# EAGLE design ItsyBitsy_Basic (EAGLE 9.6.2)
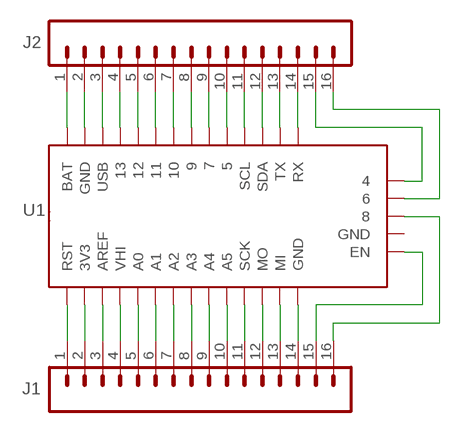
[diagram p0: schematic, sheet 1]

## Parts
J1  CONN_161X16_NO_SILK  [1X16_NO_SILK]
J2  CONN_161X16_NO_SILK  [1X16_NO_SILK]
U1  ITSYBITSY-32U4-3V  [ITSYBITYS-32U4]

## Nets
3V-5V: J1.2 U1.P$2(3V3)
4: J2.15 U1.P$19
5: J2.10 U1.P$24
6: J2.16 U1.P$18
7: J2.9 U1.P$25
8: J1.16 U1.P$17
9: J2.8 U1.P$26
10: J2.7 U1.P$27
11: J2.6 U1.P$28
12: J2.5 U1.P$29
13: J2.4 U1.P$30
A0: J1.5 U1.P$5(A0)
A1: J1.6 U1.P$6(A1)
A2: J1.7 U1.P$7(A2)
A3: J1.8 U1.P$8(A3)
A4: J1.9 U1.P$9(A4)
A5: J1.10 U1.P$10(A5)
AREF: J1.3 U1.P$3(AREF)
BAT: J2.1 U1.P$33(BAT)
EN: J1.15 U1.P$15(EN)
GND: J2.2 U1.P$32(GND)
GND-3V: J1.14 U1.P$14(GND)
M0: J1.12 U1.P$12(MO)
MI: J1.13 U1.P$13(MI)
RST: J1.1 U1.P$1(RST)
RX: J2.14 U1.P$20(RX)
SCK: J1.11 U1.P$11(SCK)
SCL: J2.11 U1.P$23(SCL)
SDA: J2.12 U1.P$22(SDA)
TX: J2.13 U1.P$21(TX)
USB: J2.3 U1.P$31(USB)
VHI-GND: J1.4 U1.P$4(VHI)

## Power pins joined to a net without a drawn wire
GND: U1.P$16(GND)

## Library data of the parts
J1 J2 = SparkFun-Connectors:CONN_16: Multi connection point. Often used as Generic Header-pin footprint for 0.1 inch spaced/style header connections On any of the 0.1 inch spaced packages, you can populate with these: Break Away Headers - Straight <https://www.sparkfun.com/products/116> (PRT-00116) Break Away Male Headers - Right Angle <https://www.sparkfun.com/products/553> (PRT-00553) Female Headers <https://www.sparkfun.com/products/115> (PRT-00115) Break Away Headers - Machine Pin <https://www.sparkfun.com/products/117> (PRT-00117) Break Away Female Headers - Swiss Machine Pin <https://www.sparkfun.com/products/743> (PRT-00743) For SCREWTERMINALS and SPRING TERMINALS visit here: Screw Terimnals on SparkFun.com <https://www.sparkfun.com/search/results?term=Screw+Terminals> (5mm/3.5mm/2.54mm spacing) This device is also useful as a general connection point to wire up your design to another part of your project. Our various solder wires solder well into these plated through hole pads. Hook-Up Wire - Assortment (Stranded, 22 AWG) <https://www.sparkfun.com/products/11375> (PRT-11375) Hook-Up Wire - Assortment (Solid Core, 22 AWG) <https://www.sparkfun.com/products/11367> (PRT-11367) View the entire wire category on our website here <https://www.sparkfun.com/categories/141> Special notes: Molex polarized connector foot print use with SKU : PRT-08231 with associated crimp pins and housings. 1MM SMD Version SKU: PRT-10208 NOTES ON THE VARIANTS LOCK and LOCK_LONGPADS... This footprint was designed to help hold the alignment of a through-hole component (i.e. 6-pin header) while soldering it into place. You may notice that each hole has been shifted either up or down by 0.005 of an inch from it's more standard position (which is a perfectly straight line). This slight alteration caused the pins (the squares in the middle) to touch the edges of the holes. Because they are alternating, it causes a "brace" to hold the component in place. 0.005 has proven to be the perfect amount of "off-center" position when using our standard breakaway headers. Although looks a little odd when you look at the bare footprint, once you have a header in there, the alteration is very hard to notice. Also,if you push a header all the way into place, it is covered up entirely on the bottom side.
U1 = home:ITSYBITSY-32U4-3V

## Net classes
0 default: width 0.203 mm

## Board
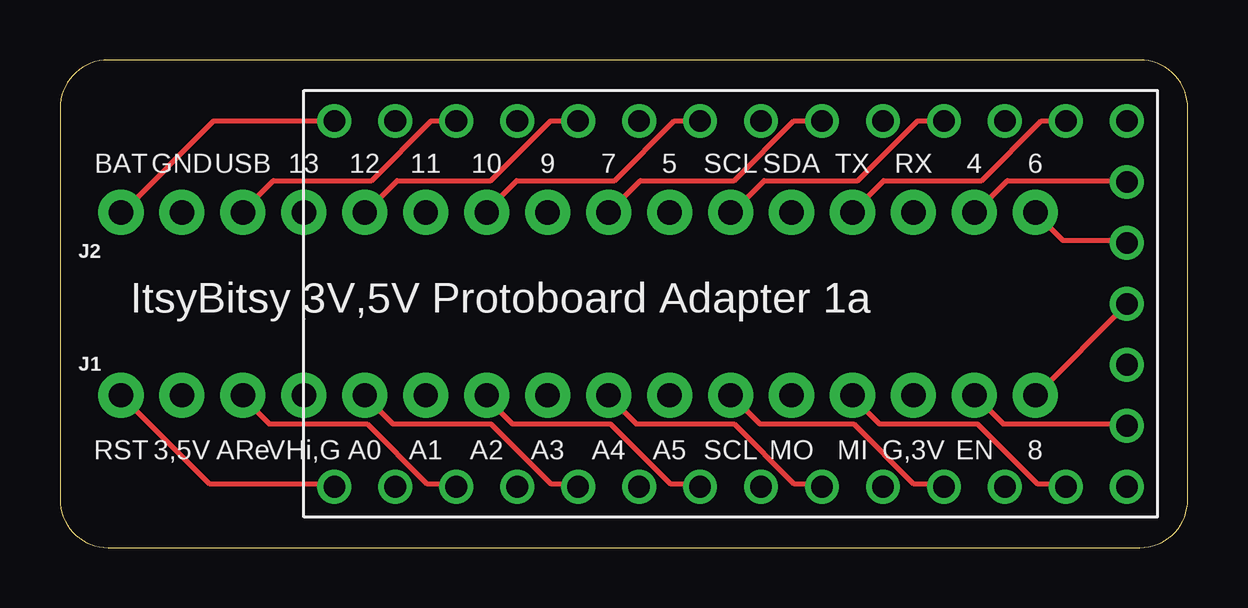
[diagram p1: board, top side]
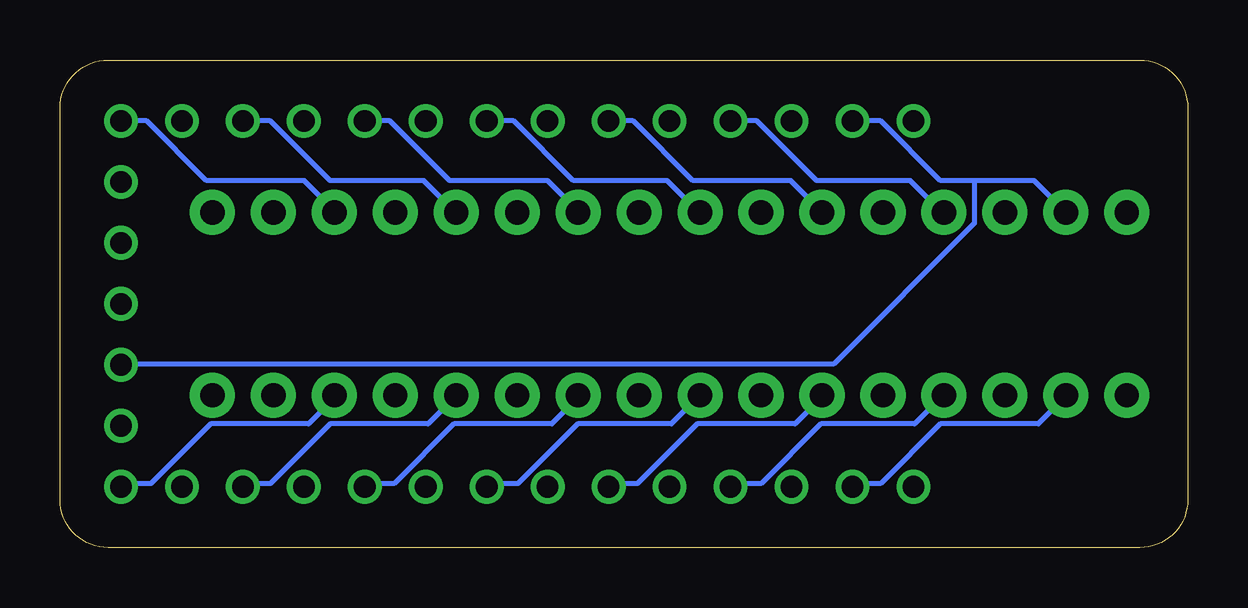
[diagram p2: board, bottom side, seen from below]

Size 46.99 x 20.32 mm. Coordinates in mm from the lower left corner, seen from the top.
Outline: 0,18.32 0,2 arc90 2,0 44.99,0 arc90 46.99,2 46.99,18.32 arc90 44.99,20.32 2,20.32 arc90 0,18.32
Copper layers (1*16): Top 0.035mm / dielectric 1.5mm / Bottom 0.035mm
Design rules "default": minimum track width 6mil, minimum drill 0.35mm, track to track 6mil, track to pad 6mil, pad to pad 6mil, via to via 6mil, smd to smd 6mil, copper to edge 40mil, drill to drill 6mil, minimum pad ring 10mil, minimum via ring 8mil, stop-mask expansion 4mil, vias tented up to drill 0mil, thermal gap 10mil

### Footprints (pad centres in the part's own frame; a part is rotated, then mirrored left to right if it is on the bottom)
1X16_NO_SILK = drill 1.016 pad 1.88: 1 0,0; 2 2.54,0; 3 5.08,0; 4 7.62,0; 5 10.16,0; 6 12.7,0; 7 15.24,0; 8 17.78,0; 9 20.32,0; 10 22.86,0; 11 25.4,0; 12 27.94,0; 13 30.48,0; 14 33.02,0; 15 35.56,0; 16 38.1,0
ITSYBITYS-32U4 = drill 0.9: P$1 -6.35,-7.62; P$2 -3.81,-7.62; P$3 -1.27,-7.62; P$4 1.27,-7.62; P$5 3.81,-7.62; P$6 6.35,-7.62; P$7 8.89,-7.62; P$8 11.43,-7.62; P$9 13.97,-7.62; P$10 16.51,-7.62; P$11 19.05,-7.62; P$12 21.59,-7.62; P$13 24.13,-7.62; P$14 26.67,-7.62; P$15 26.67,-5.08; P$16 26.67,-2.54; P$17 26.67,0; P$18 26.67,2.54; P$19 26.67,5.08; P$20 26.67,7.62; P$21 24.13,7.62; P$22 21.59,7.62; P$23 19.05,7.62; P$24 16.51,7.62; P$25 13.97,7.62; P$26 11.43,7.62; P$27 8.89,7.62; P$28 6.35,7.62; P$29 3.81,7.62; P$30 1.27,7.62; P$31 -1.27,7.62; P$32 -3.81,7.62; P$33 -6.35,7.62

### Placement (x,y rotation side)
J1  2.54,6.35 0 top
J2  2.54,13.97 0 top
U1  17.78,10.16 0 top

### Tracks (layer width: path | path; a pad name or v marks a point on that pad's centre or on a via)
3V-5V
  Bottom 0.203: U1.P$2 13.87,2.67 12.8,2.67 10.31,5.16 6.22,5.16 5.16,6.22 J1.2
4
  Top 0.203: U1.P$19 44.45,15.29 39.47,15.29 38.23,14.05 J2.15
5
  Bottom 0.203: U1.P$24 33.25,17.78 30.76,15.29 26.67,15.29 25.43,14.05 J2.10
6
  Top 0.203: U1.P$18 44.45,12.8 41.78,12.8 40.72,13.87 J2.16
7
  Top 0.203: U1.P$25 30.58,17.78 28.09,15.29 24.18,15.29 J2.9
8
  Top 0.203: U1.P$17 44.45,10.13 40.72,6.4 J1.16
9
  Bottom 0.203: U1.P$26 28.09,17.78 25.6,15.29 21.69,15.29 20.45,14.05 J2.8
10
  Top 0.203: U1.P$27 25.6,17.78 23.11,15.29 19.02,15.29 17.78,14.05 J2.7
11
  Bottom 0.203: U1.P$28 23.11,17.78 20.62,15.29 16.54,15.29 15.29,14.05 J2.6
12
  Top 0.203: U1.P$29 20.45,17.78 17.96,15.29 14.05,15.29 12.8,14.05 J2.5
13
  Bottom 0.203: U1.P$30 17.96,17.78 15.47,15.29 11.56,15.29 10.31,14.05 J2.4
A0
  Top 0.203: U1.P$5 21.51,2.67 20.45,2.67 17.96,5.16 13.87,5.16 12.8,6.22 J1.5
A1
  Bottom 0.203: U1.P$6 24,2.67 22.94,2.67 20.45,5.16 16.36,5.16 15.29,6.22 J1.6
A2
  Top 0.203: U1.P$7 26.67,2.67 25.43,2.67 22.94,5.16 18.85,5.16 17.78,6.22 J1.7
A3
  Bottom 0.203: J1.8 21.51,5.16 25.43,5.16 27.91,2.67 29.16,2.67 U1.P$8
A4
  Top 0.203: U1.P$9 31.65,2.67 30.58,2.67 28.09,5.16 24,5.16 22.94,6.22 J1.9
A5
  Bottom 0.203: U1.P$10 34.14,2.67 33.07,2.67 30.58,5.16 26.49,5.16 25.43,6.22 J1.10
AREF
  Top 0.203: U1.P$3 16.36,2.67 15.29,2.67 12.8,5.16 8.71,5.16 7.64,6.22 J1.3
BAT
  Top 0.203: U1.P$33 6.4,17.78 2.67,14.05 J2.1
EN
  Top 0.203: J1.15 39.29,5.16 44.45,5.16 U1.P$15
GND
  Bottom 0.203: U1.P$32 12.8,17.78 10.31,15.29 8.89,15.29 | 8.89,15.29 6.4,15.29 J2.2 | 8.89,15.29 8.89,13.51 14.76,7.64 44.45,7.64 U1.P$16
GND-3V
  Bottom 0.203: U1.P$14 44.45,2.67 43.2,2.67 40.72,5.16 36.63,5.16 35.56,6.22 J1.14
M0
  Bottom 0.203: U1.P$12 39.29,2.67 38.23,2.67 35.74,5.16 31.65,5.16 30.58,6.22 J1.12
MI
  Top 0.203: U1.P$13 41.78,2.67 40.72,2.67 38.23,5.16 34.14,5.16 33.07,6.22 J1.13
RST
  Top 0.203: J1.1 6.22,2.67 11.38,2.67 U1.P$1
RX
  Bottom 0.203: U1.P$20 43.38,17.78 40.89,15.29 36.8,15.29 35.56,14.05 J2.14
SCK
  Top 0.203: U1.P$11 36.8,2.67 35.56,2.67 33.07,5.16 29.16,5.16 28.09,6.22 J1.11
SCL
  Top 0.203: U1.P$23 35.74,17.78 33.25,15.29 29.34,15.29 28.09,14.05 J2.11
SDA
  Bottom 0.203: U1.P$22 38.23,17.78 35.74,15.29 31.83,15.29 30.58,14.05 J2.12
TX
  Top 0.203: U1.P$21 40.89,17.78 38.41,15.29 34.31,15.29 33.07,14.05 J2.13
USB
  Top 0.203: U1.P$31 15.47,17.78 12.98,15.29 8.89,15.29 7.64,14.05 J2.3
VHI-GND
  Bottom 0.203: U1.P$4 19.02,2.67 17.78,2.67 15.29,5.16 11.38,5.16 10.31,6.22 J1.4

### Text on the board
tPlace: BAT | GND | USB | 13 | 12 | 11 | 10 | 9 | 7 | 5 | SCL | SDA | TX | RX | 4 | 6 | ItsyBitsy 3V,5V Protoboard Adapter 1a | RST | 3,5V | ARe | VHi,G | A0 | A1 | A2 | A3 | A4 | A5 | SCL | MO | MI | G,3V | EN | 8